# EAGLE schematic BD0005_1 (main) (EAGLE 9.6.2)
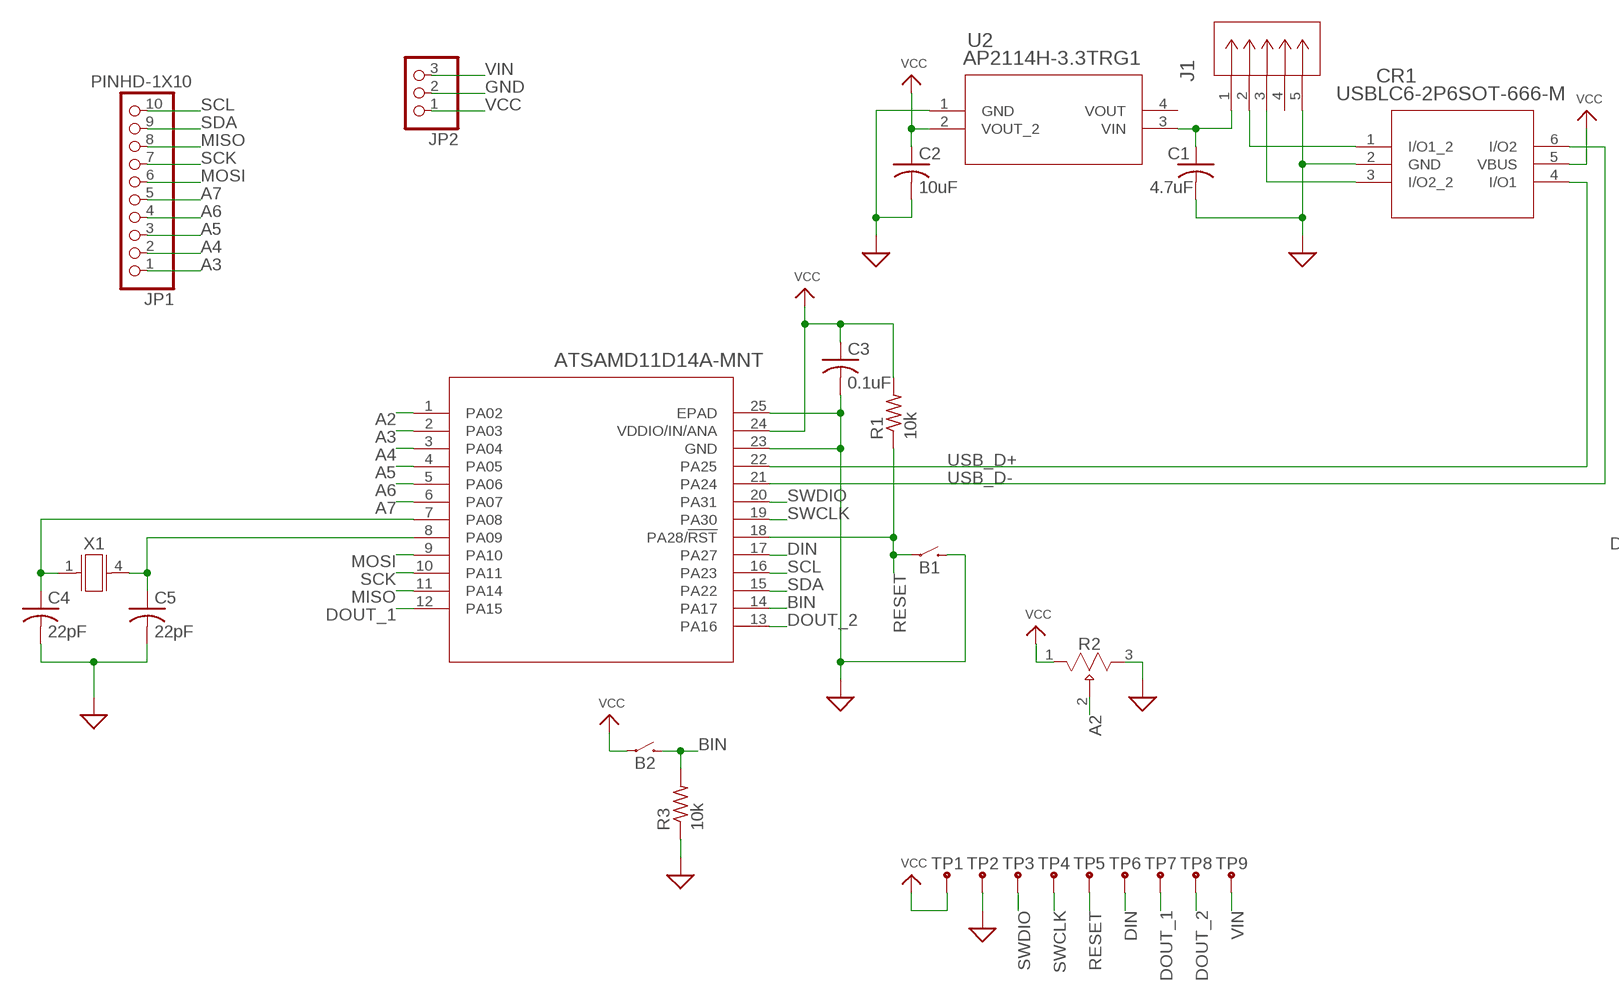
[diagram p0: schematic, sheet 1, part 1 of 2]
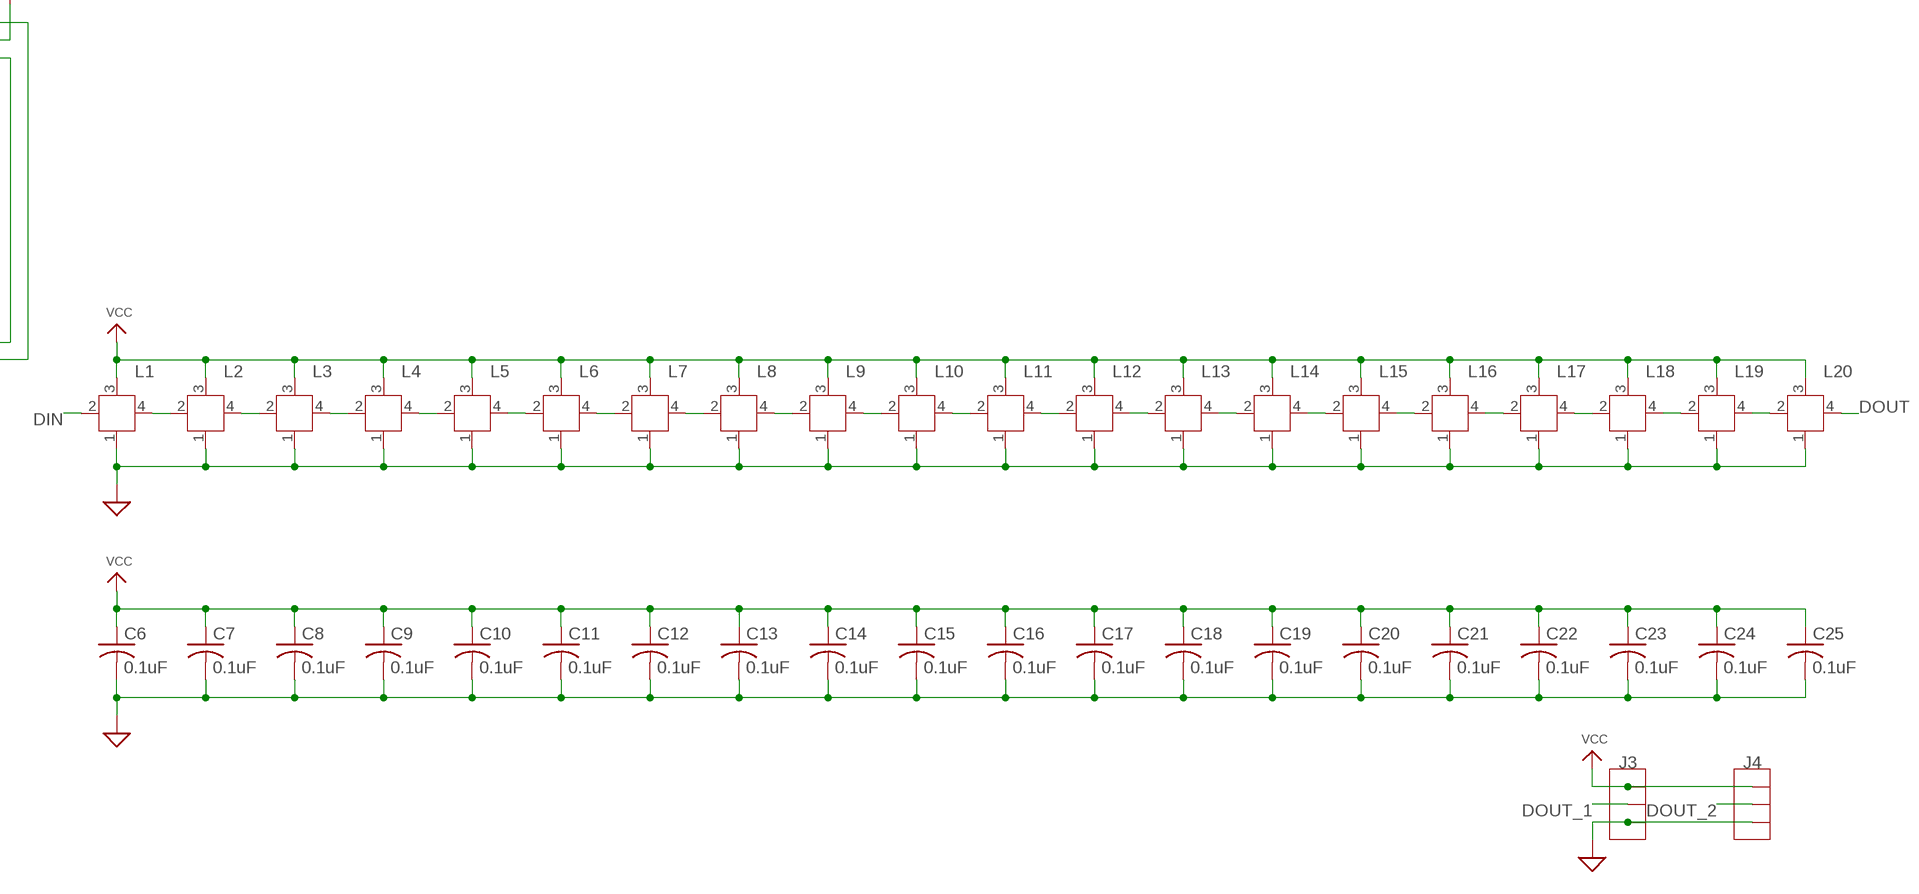
[diagram p1: schematic, sheet 1, part 2 of 2]

## Parts
B1  EVQ-P7A01P  [4-SMD_BUTTON]
B2  EVQ-P7A01P  [4-SMD_BUTTON]
C1  4.7uF  C-USC0805  [C0805]
C2  10uF  C-USC0805  [C0805]
C3  0.1uF  C-USC0402  [C0402]
C4  22pF  C-USC0402  [C0402]
C5  22pF  C-USC0402  [C0402]
C6  0.1uF  C-USC0402  [C0402]
C7  0.1uF  C-USC0402  [C0402]
C8  0.1uF  C-USC0402  [C0402]
C9  0.1uF  C-USC0402  [C0402]
C10  0.1uF  C-USC0402  [C0402]
C11  0.1uF  C-USC0402  [C0402]
C12  0.1uF  C-USC0402  [C0402]
C13  0.1uF  C-USC0402  [C0402]
C14  0.1uF  C-USC0402  [C0402]
C15  0.1uF  C-USC0402  [C0402]
C16  0.1uF  C-USC0402  [C0402]
C17  0.1uF  C-USC0402  [C0402]
C18  0.1uF  C-USC0402  [C0402]
C19  0.1uF  C-USC0402  [C0402]
C20  0.1uF  C-USC0402  [C0402]
C21  0.1uF  C-USC0402  [C0402]
C22  0.1uF  C-USC0402  [C0402]
C23  0.1uF  C-USC0402  [C0402]
C24  0.1uF  C-USC0402  [C0402]
C25  0.1uF  C-USC0402  [C0402]
CR1  USBLC6-2P6SOT-666-M  [SOT-666-M]
J1  1050171001  [CON00679_5]
J3  HEADER_1X3FEMALE  [F3SMD]
J4  HEADER_1X3FEMALE  [F3SMD]
JP1  PINHD-1X10  [1X10-BIG]
JP2  PINHD-1X3  [1X03]
L1  WS2812B  [SK6812]
L2  WS2812B  [SK6812]
L3  WS2812B  [SK6812]
L4  WS2812B  [SK6812]
L5  WS2812B  [SK6812]
L6  WS2812B  [SK6812]
L7  WS2812B  [SK6812]
L8  WS2812B  [SK6812]
L9  WS2812B  [SK6812]
L10  WS2812B  [SK6812]
L11  WS2812B  [SK6812]
L12  WS2812B  [SK6812]
L13  WS2812B  [SK6812]
L14  WS2812B  [SK6812]
L15  WS2812B  [SK6812]
L16  WS2812B  [SK6812]
L17  WS2812B  [SK6812]
L18  WS2812B  [SK6812]
L19  WS2812B  [SK6812]
L20  WS2812B  [SK6812]
R1  10k  R-US_R0402  [R0402]
R2  3352T-1-104LF  [THUMBWHEEL]
R3  10k  R-US_R0402  [R0402]
TP1  VCC  TEST_POINT  [TEST_POINT]
TP2  GND  TEST_POINT  [TEST_POINT]
TP3  DIO  TEST_POINT  [TEST_POINT]
TP4  CLK  TEST_POINT  [TEST_POINT]
TP5  RST  TEST_POINT  [TEST_POINT]
TP6  DIN  TEST_POINT  [TEST_POINT]
TP7  DO1  TEST_POINT  [TEST_POINT]
TP8  DO2  TEST_POINT  [TEST_POINT]
TP9  VIN  TEST_POINT  [TEST_POINT]
U1  ATSAMD11D14A-MNT  [QFN24_4X4MC]
U2  AP2114H-3.3TRG1  [SOT-223]
X1  MC-146-32.7680JKA-A0:ROHS  [4-SMD_FLAT_LEADS]

## Nets
A2: R2.2 U1.1(PA02)
A3: JP1.1 U1.2(PA03)
A4: JP1.2 U1.3(PA04)
A5: JP1.3 U1.4(PA05)
A6: JP1.4 U1.5(PA06)
A7: JP1.5 U1.6(PA07)
BIN: B2.2A B2.2B R3.2 U1.14(PA17)
DIN: L1.2(DIN) TP6.P$1 U1.17(PA27)
DOUT: L20.4(DOUT)
DOUT_1: J3.2A J3.2B TP7.P$1 U1.12(PA15)
DOUT_2: J4.2A J4.2B TP8.P$1 U1.13(PA16)
GND: B1.2A B1.2B C1.2 C2.2 C3.2 C4.2 C5.2 C6.2 C7.2 C8.2 C9.2 C10.2 C11.2 C12.2 C13.2 C14.2 C15.2 C16.2 C17.2 C18.2 C19.2 C20.2 C21.2 C22.2 C23.2 C24.2 C25.2 CR1.2(GND) J1.5 J3.3A J3.3B J4.3A J4.3B JP2.2 L1.1(VSS) L2.1(VSS) L3.1(VSS) L4.1(VSS) L5.1(VSS) L6.1(VSS) L7.1(VSS) L8.1(VSS) L9.1(VSS) L10.1(VSS) L11.1(VSS) L12.1(VSS) L13.1(VSS) L14.1(VSS) L15.1(VSS) L16.1(VSS) L17.1(VSS) L18.1(VSS) L19.1(VSS) L20.1(VSS) R2.3 R3.1 TP2.P$1 U1.23(GND) U1.25(EPAD) U2.1(GND) ; supply symbol labelled SUP
MISO: JP1.8 U1.11(PA14)
MOSI: JP1.6 U1.9(PA10)
N$1: CR1.3(I/O2_2) J1.3
N$3: CR1.1(I/O1_2) J1.2
N$4: C4.1 U1.7(PA08) X1.1
N$5: C5.1 U1.8(PA09) X1.4
N$8: L19.4(DOUT) L20.2(DIN)
N$9: L18.4(DOUT) L19.2(DIN)
N$10: L17.4(DOUT) L18.2(DIN)
N$11: L16.4(DOUT) L17.2(DIN)
N$12: L15.4(DOUT) L16.2(DIN)
N$13: L14.4(DOUT) L15.2(DIN)
N$14: L13.4(DOUT) L14.2(DIN)
N$15: L12.4(DOUT) L13.2(DIN)
N$16: L11.4(DOUT) L12.2(DIN)
N$17: L10.4(DOUT) L11.2(DIN)
N$18: L9.4(DOUT) L10.2(DIN)
N$19: L8.4(DOUT) L9.2(DIN)
N$20: L7.4(DOUT) L8.2(DIN)
N$21: L1.4(DOUT) L2.2(DIN)
N$22: L2.4(DOUT) L3.2(DIN)
N$23: L3.4(DOUT) L4.2(DIN)
N$24: L4.4(DOUT) L5.2(DIN)
N$25: L5.4(DOUT) L6.2(DIN)
N$26: L6.4(DOUT) L7.2(DIN)
RESET: B1.1A B1.1B R1.1 TP5.P$1 U1.18(PA28/!RST)
SCK: JP1.7 U1.10(PA11)
SCL: JP1.10 U1.16(PA23)
SDA: JP1.9 U1.15(PA22)
SWCLK: TP4.P$1 U1.19(PA30)
SWDIO: TP3.P$1 U1.20(PA31)
USB_D+: CR1.4(I/O1) U1.22(PA25)
USB_D-: CR1.6(I/O2) U1.21(PA24)
VCC: B2.1A B2.1B C2.1 C3.1 C6.1 C7.1 C8.1 C9.1 C10.1 C11.1 C12.1 C13.1 C14.1 C15.1 C16.1 C17.1 C18.1 C19.1 C20.1 C21.1 C22.1 C23.1 C24.1 C25.1 CR1.5(VBUS) J3.1A J3.1B J4.1A J4.1B JP2.1 L1.3(VDD) L2.3(VDD) L3.3(VDD) L4.3(VDD) L5.3(VDD) L6.3(VDD) L7.3(VDD) L8.3(VDD) L9.3(VDD) L10.3(VDD) L11.3(VDD) L12.3(VDD) L13.3(VDD) L14.3(VDD) L15.3(VDD) L16.3(VDD) L17.3(VDD) L18.3(VDD) L19.3(VDD) L20.3(VDD) R1.2 R2.1 TP1.P$1 U1.24(VDDIO/IN/ANA) U2.2(VOUT_2)
VIN: C1.1 J1.1 JP2.3 TP9.P$1 U2.3(VIN)
Unconnected: J1.4 U2.4(VOUT)

## Library data of the parts
B1 B2 = Clock:EVQ-P7A01P
C1-C25 = adafruit:C-US: CAPACITOR, American symbol
CR1 = Clock:USBLC6-2P6; BUILT_BY: EMA_UL_Team; MANUFACTURER_PART_NUMBER: USBLC6-2P6; VENDOR: STMicroelectronics
J1 = Clock:1050171001; BUILT_BY: EMA_Don; COPYRIGHT: Copyright (C) 2016 Accelerated Designs. All rights reserved; MANUFACTURER_PART_NUMBER: 1050171001; VENDOR: Molex Connector Corporation
J3 J4 = Clock:HEADER_1X3
JP1 = adafruit:PINHD-1X10: Pin header 1x10 0.1" spacing With round pins
JP2 = adafruit:PINHD-1X3: PIN HEADER
L1-L20 = Clock:WS2812B
R1 R3 = adafruit:R-US_: RESISTOR, American symbol
R2 = Clock:3352T-1-104LF
TP1-TP9 = Clock:TEST_POINT
U1 = Clock:ATSAMD11D14A-MNT; BUILT_BY: EMA_Molly; COPYRIGHT: Copyright (C) 2018 Accelerated Designs. All rights reserved; MANUFACTURER_PART_NUMBER: ATSAMD11D14A-MNT; VENDOR: Microchip
U2 = Clock:AP2114H-3.3TRG1; BUILT_BY: EMA_UL_Team; MANUFACTURER_PART_NUMBER: AP2114H-3.3TRG1; VENDOR: Diodes Inc
X1 = Clock:MC-146-32.7680JKA-A0:ROHS